# Altium project MB.PrjPCB
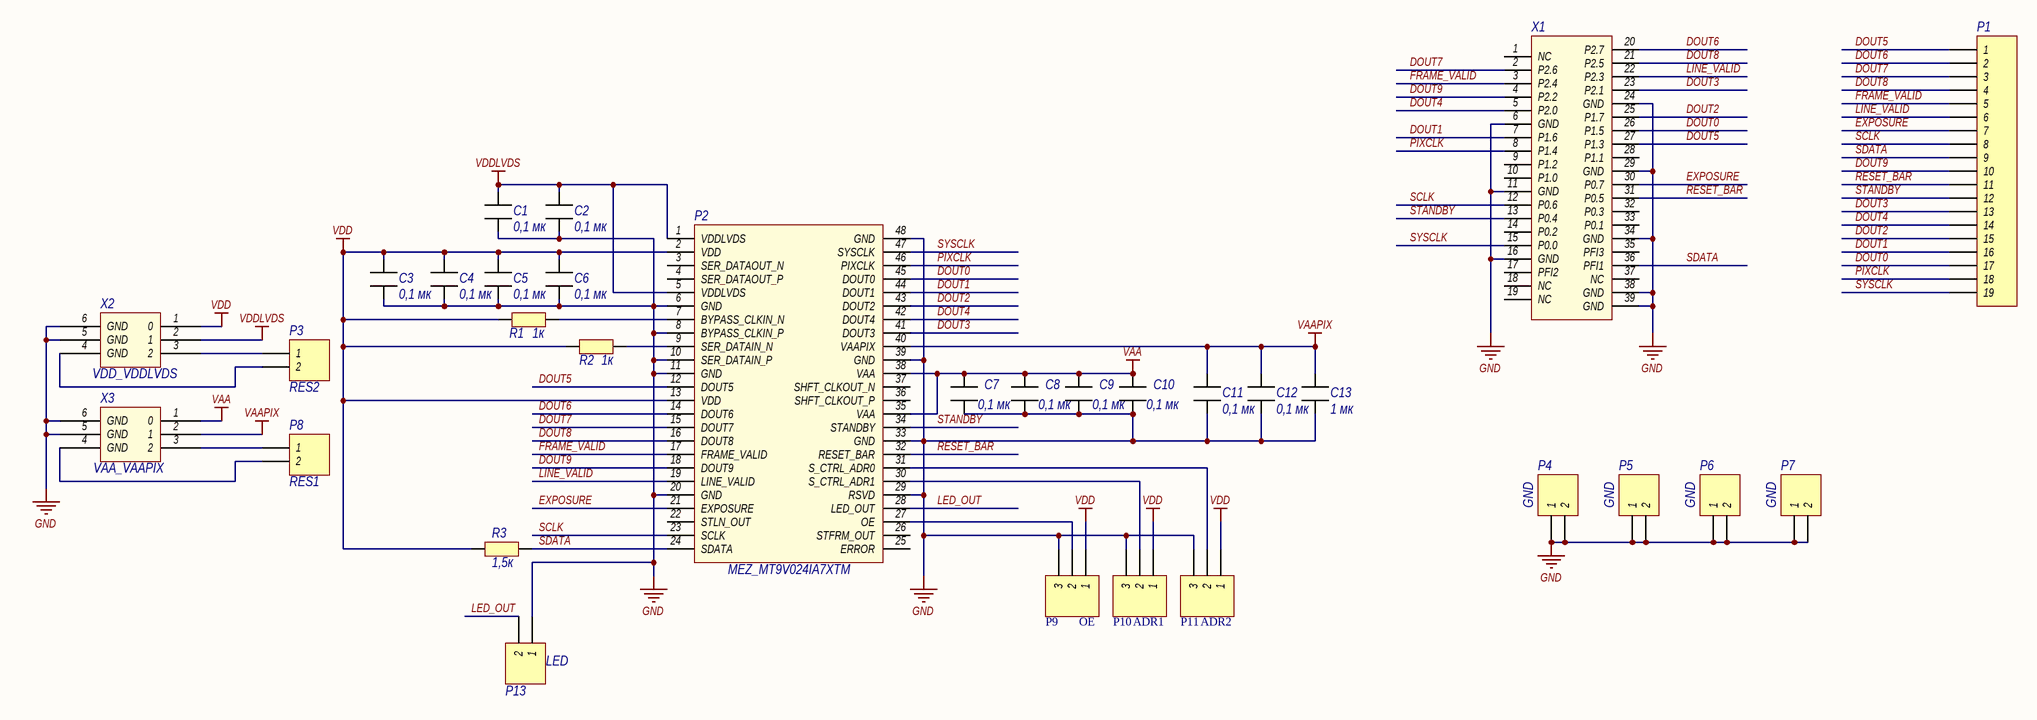
[diagram p0: MB_Sheet1.SchDoc]
1 sheet, 31 parts. Net scope: global (net labels, ports and power ports of the same name join across sheets).
Board file: MB.PcbDoc

## Sheet MB_Sheet1.SchDoc
size A3

### Parts
C1  0,1 мк  [CAP_SMALL]
C2  0,1 мк  [CAP_SMALL]
C3  0,1 мк  [CAP_SMALL]
C4  0,1 мк  [CAP_SMALL]
C5  0,1 мк  [CAP_SMALL]
C6  0,1 мк  [CAP_SMALL]
C7  0,1 мк  [CAP_SMALL]
C8  0,1 мк  [CAP_SMALL]
C9  0,1 мк  [CAP_SMALL]
C10  0,1 мк  [CAP_SMALL]
C11  0,1 мк  [CAP_SMALL]
C12  0,1 мк  [CAP_SMALL]
C13  1 мк  [CAP_SMALL]
P1  Header 19  [HDR1X19]  (value not drawn)
P2  MEZ_MT9V024IA7XTM  [MEZ_MT9V024IA7XTM]
P3  RES2  [HDR1X2]
P4  GND  [HDR1X2]
P5  GND  [HDR1X2]
P6  GND  [HDR1X2]
P7  GND  [HDR1X2]
P8  RES1  [HDR1X2]
P9  OE  [HDR1X3]
P10  ADR1  [HDR1X3]
P11  ADR2  [HDR1X3]
P13  LED  [HDR1X2]
R1  1к  [RES]
R2  1к  [RES]
R3  1,5к  [RES]
X1  CHEAP_CON_37_FEMALE  [CHEAP_CONN_FEMALE]  (value not drawn)
X2  VDD_VDDLVDS  [POWER]
X3  VAA_VAAPIX  [POWER]

### Nets
GND: C1.1 C2.1 C3.1 C4.1 C5.1 C6.1 C7.1 C8.1 C9.1 C10.1 C11.1 C12.1 C13.1 P2.6(GND) P2.8(BYPASS_CLKIN_P) P2.10(SER_DATAIN_P) P2.11(GND) P2.20(GND) P2.29(RSVD) P2.33(GND) P2.39(GND) P2.48(GND) P4.1 P4.2 P5.1 P5.2 P6.1 P6.2 P7.1 P7.2 P9.3 P10.3 P11.3 P13.1 X1.6(GND) X1.11(GND) X1.16(GND) X1.24(GND) X1.29(GND) X1.34(GND) X1.38(GND) X1.39(GND) X2.5(GND) X2.6(GND) X3.5(GND) X3.6(GND)
VAA: C7.2 C8.2 C9.2 C10.2 P2.35(VAA) P2.38(VAA) X3.1(0)
VAAPIX: C11.2 C12.2 C13.2 P2.40(VAAPIX) X3.2(1)
VDD: C3.2 C4.2 C5.2 C6.2 P2.2(VDD) P2.13(VDD) P9.1 P10.1 P11.1 R1.1 R2.2 R3.1 X2.1(0)
VDDLVDS: C1.2 C2.2 P2.1(VDDLVDS) P2.5(VDDLVDS) X2.2(1)
DOUT0: P1.17 P2.45(DOUT0) X1.26(P1.5)
DOUT1: P1.16 P2.44(DOUT1) X1.7(P1.6)
DOUT2: P1.15 P2.43(DOUT2) X1.25(P1.7)
DOUT3: P1.13 P2.41(DOUT3) X1.23(P2.1)
DOUT4: P1.14 P2.42(DOUT4) X1.5(P2.0)
DOUT5: P1.1 P2.12(DOUT5) X1.27(P1.3)
DOUT6: P1.2 P2.14(DOUT6) X1.20(P2.7)
DOUT7: P1.3 P2.15(DOUT7) X1.2(P2.6)
DOUT8: P1.4 P2.16(DOUT8) X1.21(P2.5)
DOUT9: P1.10 P2.18(DOUT9) X1.4(P2.2)
EXPOSURE: P1.7 P2.21(EXPOSURE) X1.30(P0.7)
FRAME_VALID: P1.5 P2.17(FRAME_VALID) X1.3(P2.4)
LED_OUT: P2.28(LED_OUT) P13.2
LINE_VALID: P1.6 P2.19(LINE_VALID) X1.22(P2.3)
PIXCLK: P1.18 P2.46(PIXCLK) X1.8(P1.4)
RESET_BAR: P1.11 P2.32(RESET_BAR) X1.31(P0.5)
SCLK: P1.8 P2.23(SCLK) X1.12(P0.6)
SDATA: P1.9 P2.24(SDATA) R3.2 X1.36(PFI1)
STANDBY: P1.12 P2.34(STANDBY) X1.13(P0.4)
SYSCLK: P1.19 P2.47(SYSCLK) X1.15(P0.0)
NetP2_7: P2.7(BYPASS_CLKIN_N) R1.2
NetP2_9: P2.9(SER_DATAIN_N) R2.1
NetP2_27: P2.27(OE) P9.2
NetP2_30: P2.30(S_CTRL_ADR1) P10.2
NetP2_31: P2.31(S_CTRL_ADR0) P11.2
NetP3_1: P3.1 X2.3(2)
NetP3_2: P3.2 X2.4(GND)
NetP8_1: P8.1 X3.3(2)
NetP8_2: P8.2 X3.4(GND)

Not connected (* = marked no-connect by the designer): P2 3(SER_DATAOUT_N) 4(SER_DATAOUT_P) 22(STLN_OUT) 25(ERROR) 26(STFRM_OUT) 36(SHFT_CLKOUT_P) 37(SHFT_CLKOUT_N); X1 1(NC) 9(P1.2) 10(P1.0) 14(P0.2) 17(PFI2) 18(NC) 19(NC) 28(P1.1) 32(P0.3) 33(P0.1) 35(PFI3) 37(NC)

### Library data of the parts
C1-C13 = CAP_SMALL
P1 = Header 19: Header, 19-Pin; LatestRevisionDate: 17-Jul-2002; LatestRevisionNote: Re-released for DXP Platform.; Publisher: Altium Limited
P3-P8 P13 = Header 2: Header, 2-Pin; LatestRevisionDate: 17-Jul-2002; LatestRevisionNote: Re-released for DXP Platform.; Publisher: Altium Limited
P9-P11 = Header 3: Header, 3-Pin; LatestRevisionDate: 17-Jul-2002; LatestRevisionNote: Re-released for DXP Platform.; Publisher: Altium Limited
R1-R3 = RES
X2 X3 = POWER